# Altium schematic sheet ChangeNote.SchDoc
size 420 x 297 mm; SheetNumber: 32; SheetTotal: 32
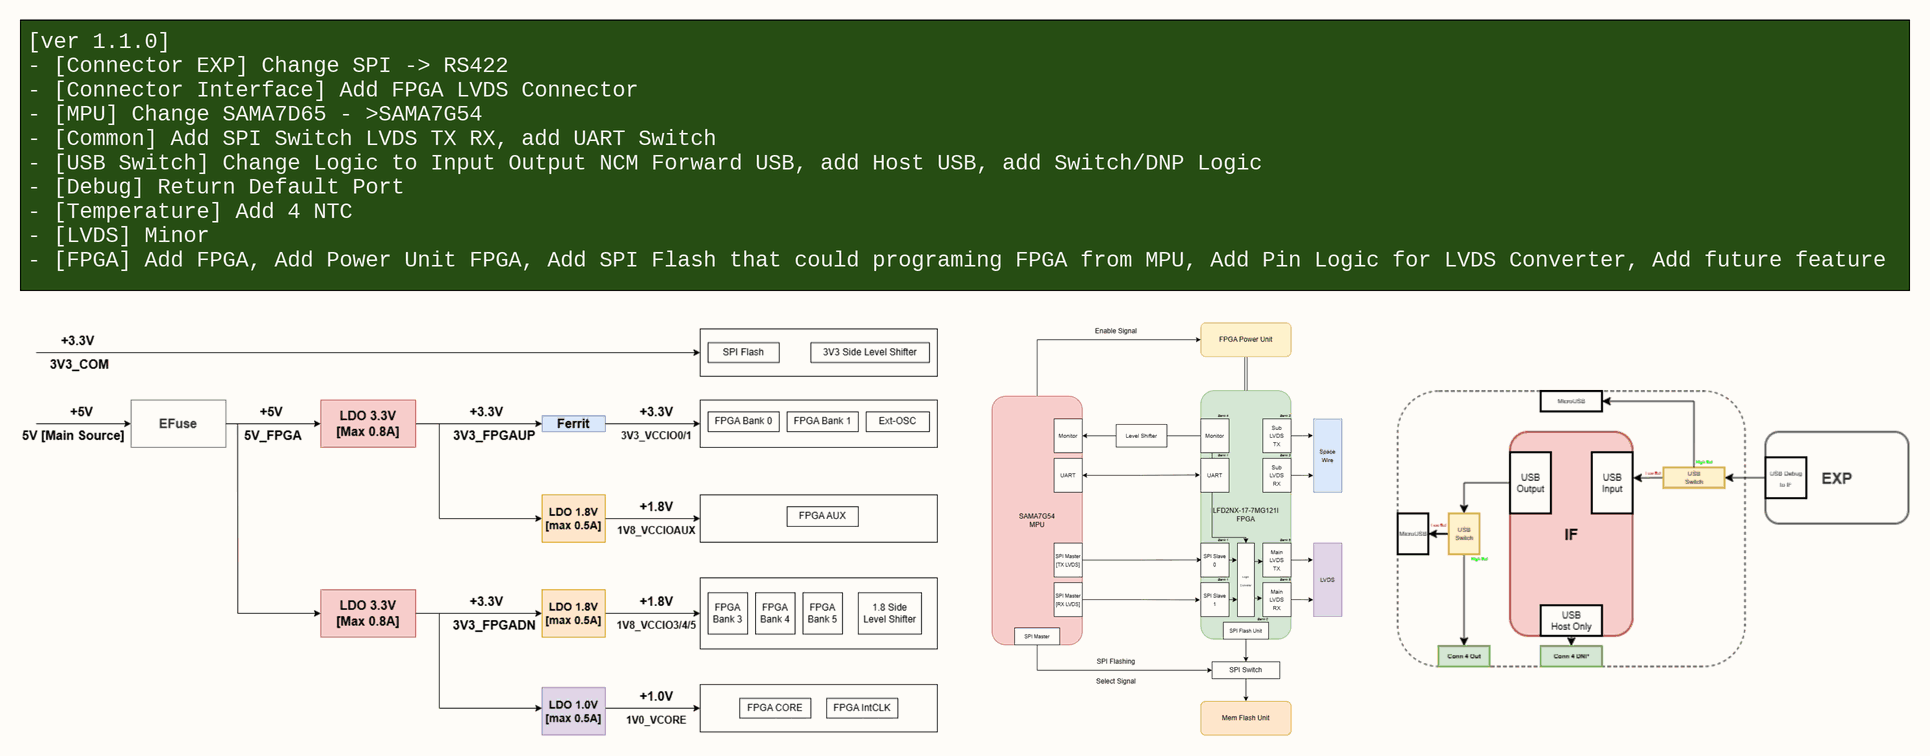
[diagram p0: ChangeNote.SchDoc]

## Notes on the sheet
- [ver 1.1.0]
  - [Connector EXP] Change SPI -> RS422
  - [Connector Interface] Add FPGA LVDS Connector
  - [MPU] Change SAMA7D65 - >SAMA7G54
  - [Common] Add SPI Switch LVDS TX RX, add UART Switch
  - [USB Switch] Change Logic to Input Output NCM Forward USB, add Host USB, add Switch/DNP Logic
  - [Debug] Return Default Port
  - [Temperature] Add 4 NTC
  - [LVDS] Minor
  - [FPGA] Add FPGA, Add Power Unit FPGA, Add SPI Flash that could programing FPGA from MPU, Add Pin Logic for LVDS Converter, Add future feature SpaceWire
- Project:
- Sub-system:
- Design by:
- Sheet title:
- Sheet
- A3
- of
- Checked by:
- Approved by:
- Revision:
- Document No:
- Size:
- Date: